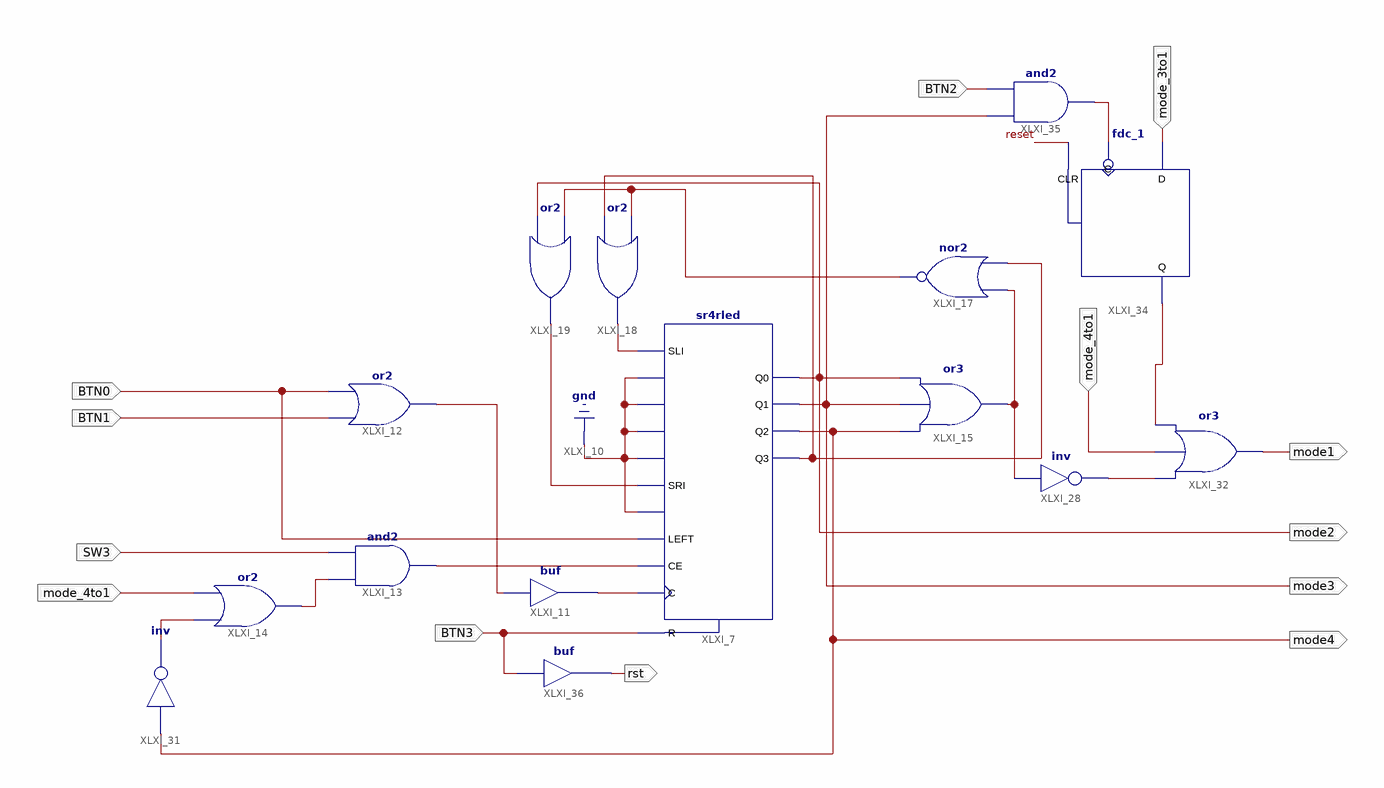
[diagram p0: schematic sheet 1]
// Xilinx ISE schematic mode_switch.sch (spartan3) as structural Verilog: 15 symbols, 12 ports
module mode_switch (
  input  SW3,
  input  BTN1,
  input  BTN0,
  input  BTN2,
  input  mode_4to1,
  input  mode_3to1,
  input  BTN3,
  output mode3,
  output mode2,
  output mode4,
  output mode1,
  output rst
);

  wire reset, XLXN_14, XLXN_15, XLXN_21, XLXN_33, XLXN_34, XLXN_35, XLXN_43, XLXN_44, XLXN_50, XLXN_60,
       XLXN_76, XLXN_83, XLXN_85;

  buf XLXI_11 (XLXN_14, XLXN_15);
  or XLXI_12 (XLXN_15, BTN1, BTN0);
  sr4rled XLXI_7 (
    .C(XLXN_14), .CE(XLXN_50), .D0(1'b0), .D1(1'b0), .D2(1'b0), .D3(1'b0), .L(1'b0), .LEFT(BTN0), .R(BTN3),
    .SLI(XLXN_43), .SRI(XLXN_44), .Q0(mode2), .Q1(mode3), .Q2(mode4), .Q3(XLXN_34));
  or XLXI_15 (XLXN_33, mode4, mode3, mode2);
  nor XLXI_17 (XLXN_35, XLXN_34, XLXN_33);
  or XLXI_19 (XLXN_44, mode2, XLXN_35);
  or XLXI_18 (XLXN_43, XLXN_34, XLXN_35);
  not XLXI_28 (XLXN_76, XLXN_33);
  and XLXI_13 (XLXN_50, XLXN_21, SW3);
  or XLXI_14 (XLXN_21, XLXN_60, mode_4to1);
  not XLXI_31 (XLXN_60, mode4);
  or XLXI_32 (mode1, XLXN_76, mode_4to1, XLXN_85);
  fdc_1 XLXI_34 (.C(XLXN_83), .CLR(reset), .D(mode_3to1), .Q(XLXN_85));
  and XLXI_35 (XLXN_83, mode3, BTN2);
  buf XLXI_36 (rst, BTN3);
endmodule
